# Altium schematic sheet P1.schdoc
size 127 x 101 mm
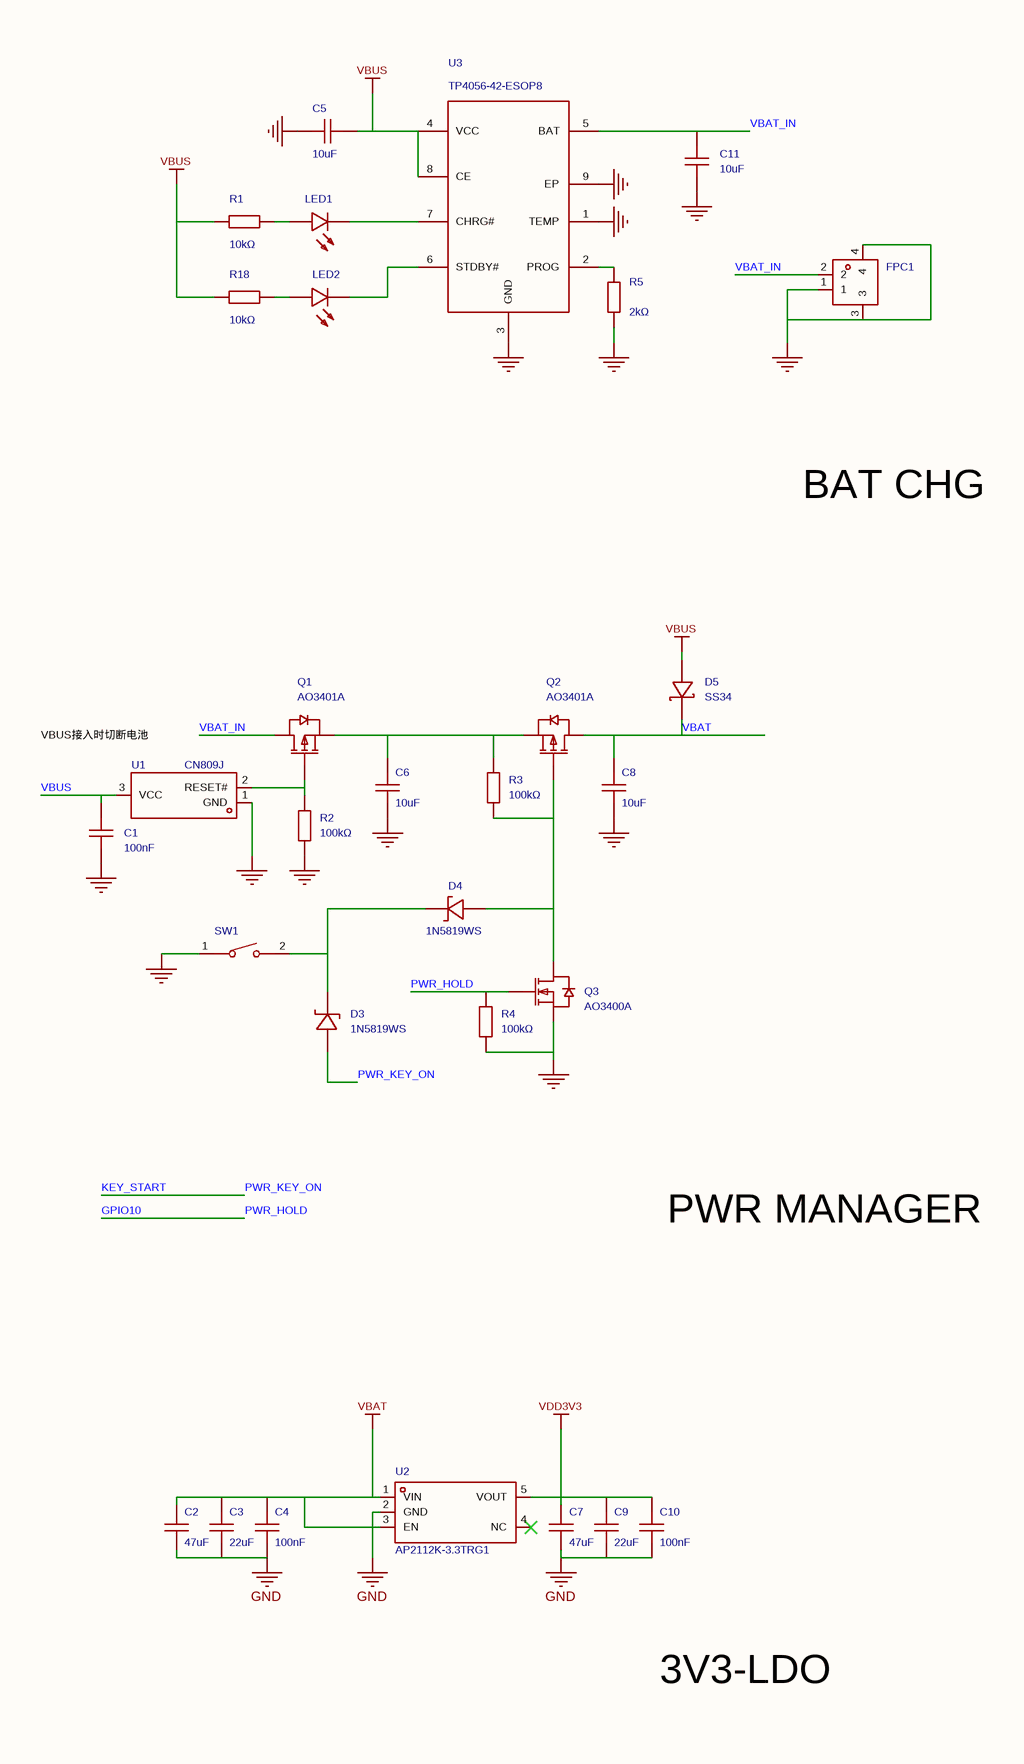
[diagram p0: P1.schdoc, left]
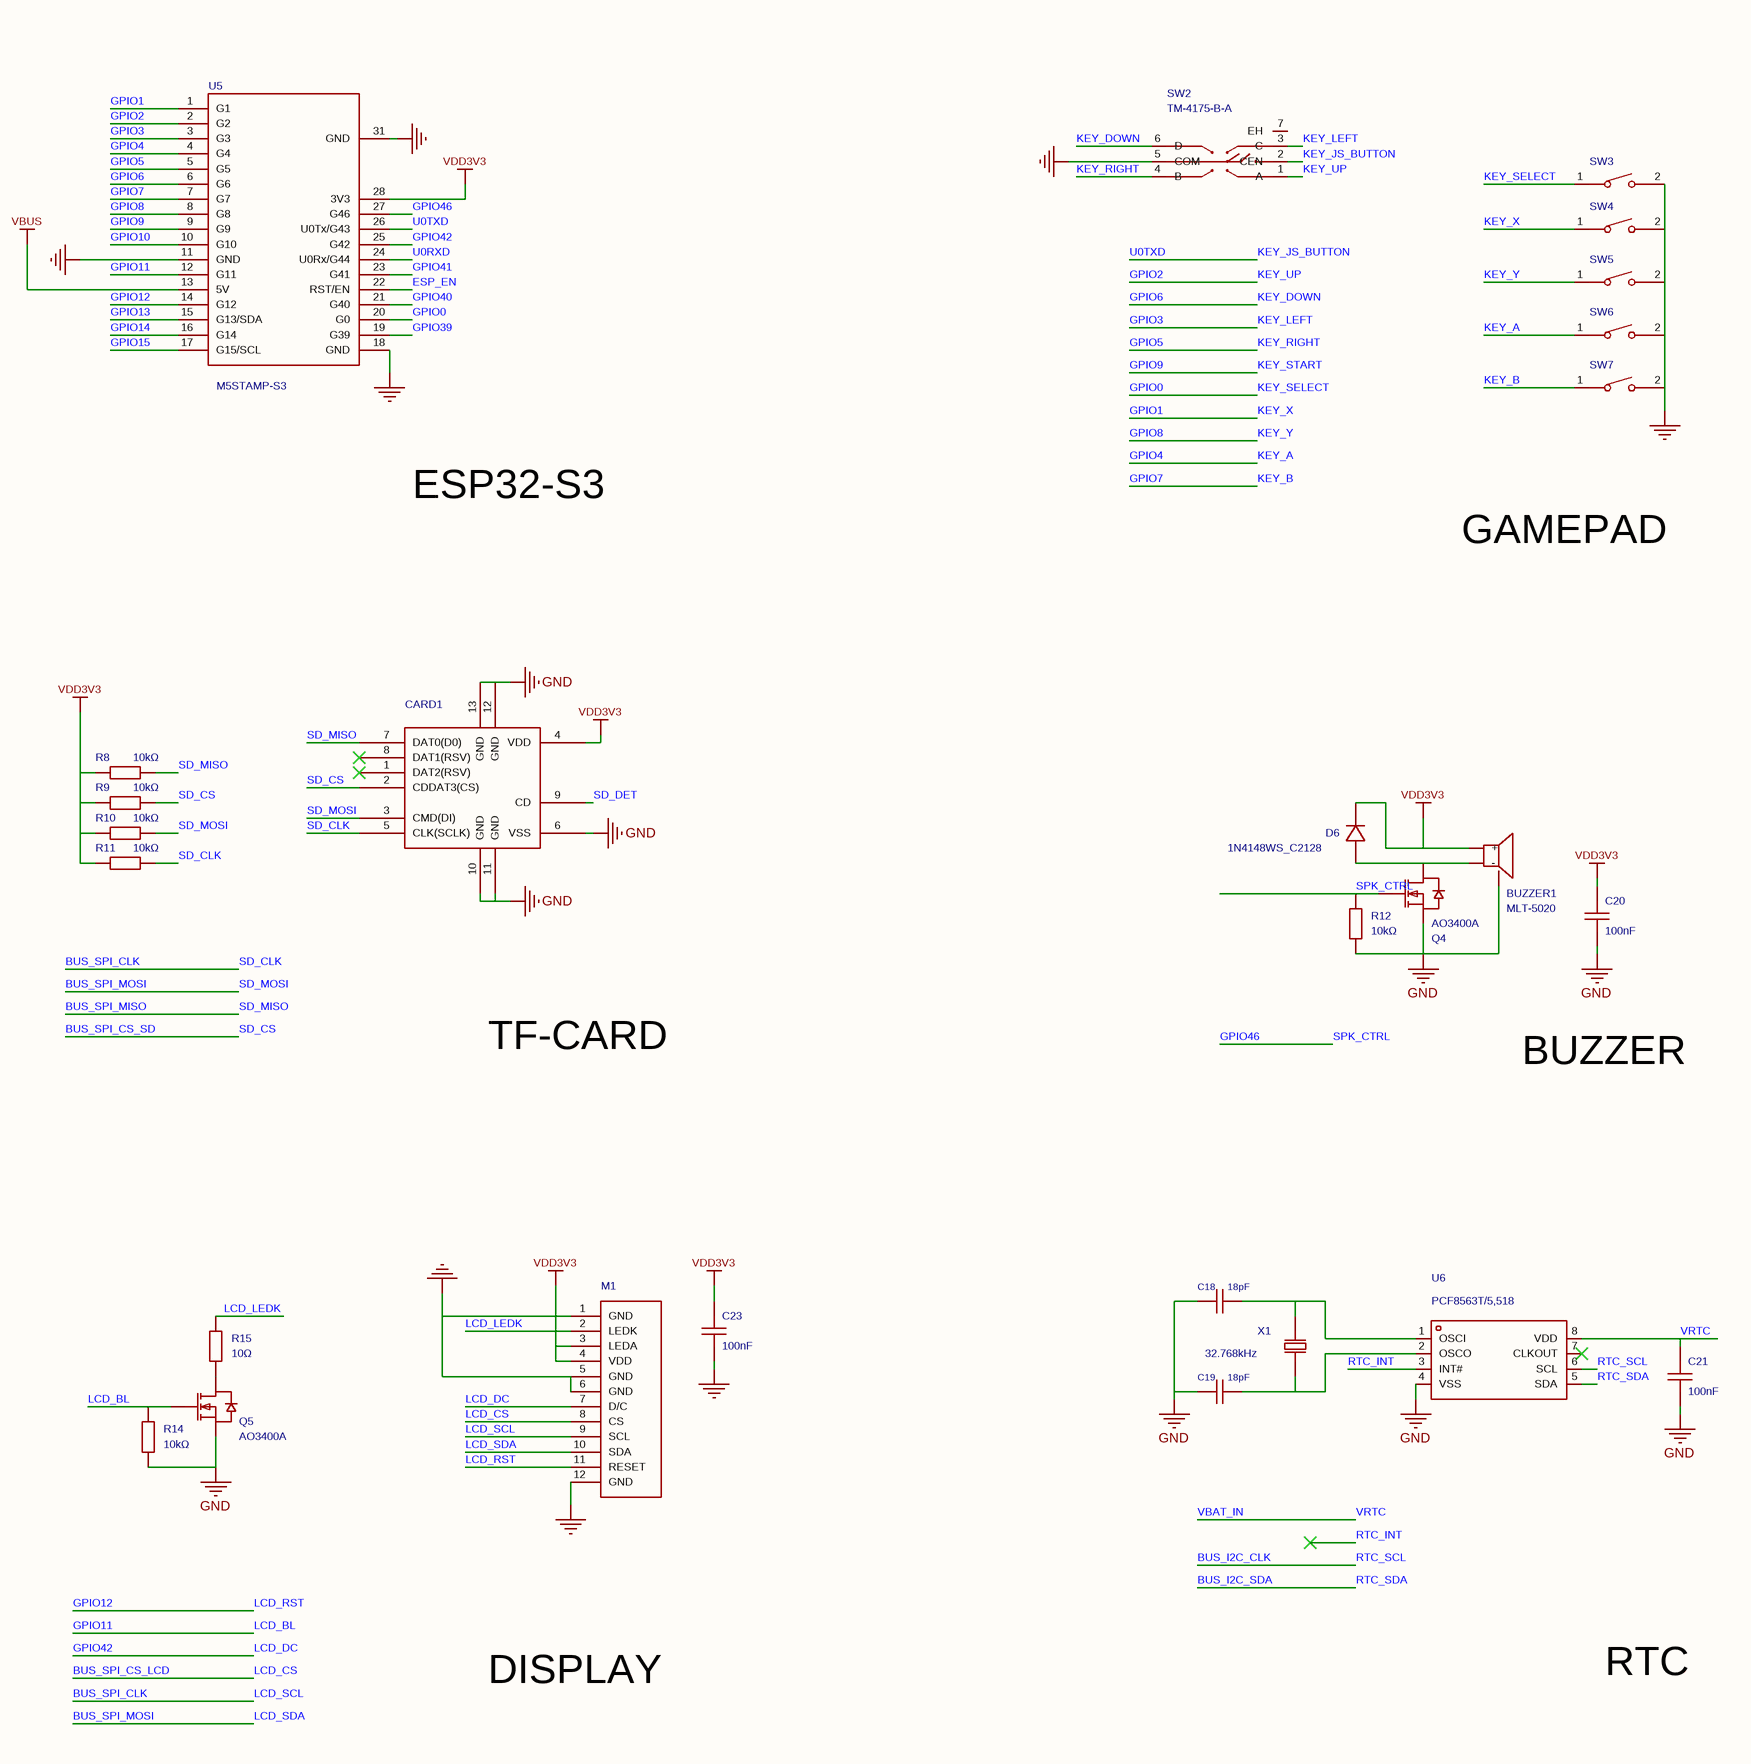
[diagram p1: P1.schdoc, middle]
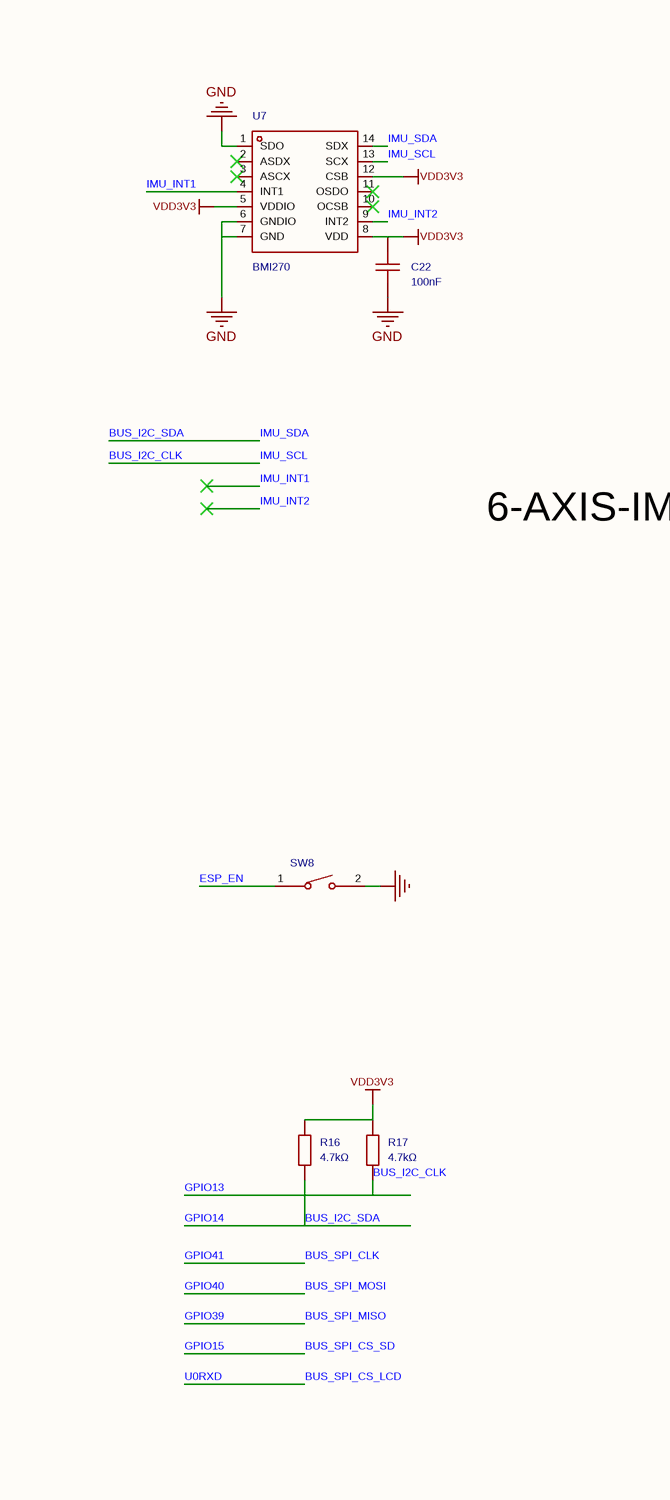
[diagram p2: P1.schdoc, right]

## Parts
BUZZER1  4000Hz  [BUZ-SMD_L5.0-W5.5-P4.60]  (value not drawn)
C1  100nF  [C0603]
C2  47uF  [C0805]
C3  22uF  [C0805]
C4  100nF  [C0603]
C5  10uF  [C0603]
C6  10uF  [C0603]
C7  47uF  [C0805]
C8  10uF  [C0603]
C9  22uF  [C0805]
C10  100nF  [C0603]
C11  10uF  [C0603]
C18  18pF  [C0603]
C19  18pF  [C0603]
C20  100nF  [C0603]
C21  100nF  [C0603]
C22  100nF  [C0603]
C23  100nF  [C0603]
CARD1  (no value)  [TF-SMD_TF-01A]
D3  1N5819WS  [SOD-323_L1.8-W1.3-LS2.5-RD]
D4  1N5819WS  [SOD-323_L1.8-W1.3-LS2.5-RD]
D5  SS34  [SMA_L4.3-W2.6-LS5.2-RD]
D6  1N4148WS  [SOD-323_L1.8-W1.3-LS2.5-RD]  (value not drawn)
FPC1  1.25-2PWB  [CONN-SMD_2P-P1.25_DEALON_1.25-2PWB]  (value not drawn)
LED1  19-213/Y2C-CQ2R2L/3T(CY)  [LED0603-RD-YELLOW]  (value not drawn)
LED2  19-217/GHC-YR1S2/3T  [LED0603-RD]  (value not drawn)
M1  1.3寸TFT240*240  [1.3寸TFT240_240]  (value not drawn)
Q1  AO3401A  [SOT-23_L2.9-W1.3-P1.90-LS2.4-BR]
Q2  AO3401A  [SOT-23_L2.9-W1.3-P1.90-LS2.4-BR]
Q3  AO3400A  [sot-23_l2.9-w1.3-p1.90-ls2.4-br]
Q4  AO3400A  [sot-23_l2.9-w1.3-p1.90-ls2.4-br]
Q5  AO3400A  [sot-23_l2.9-w1.3-p1.90-ls2.4-br]
R1  10kΩ  [R0603]
R2  100kΩ  [R0603]
R3  100kΩ  [R0603]
R4  100kΩ  [R0603]
R5  2kΩ  [R0603]
R8  10kΩ  [R0603]
R9  10kΩ  [R0603]
R10  10kΩ  [R0603]
R11  10kΩ  [R0603]
R12  10kΩ  [R0603]
R14  10kΩ  [R0603]
R15  10Ω  [R0603]
R16  4.7kΩ  [R0603]
R17  4.7kΩ  [R0603]
R18  10kΩ  [R0603]
SW1  TS-1088-AR02016  [SW-SMD_L3.9-W3.0-P4.45]  (value not drawn)
SW2  TM-4175-B-A  [SW-SMD_TM-4175-B-X]
SW3  TS-1088-AR02016  [SW-SMD_L3.9-W3.0-P4.45]  (value not drawn)
SW4  TS-1088-AR02016  [SW-SMD_L3.9-W3.0-P4.45]  (value not drawn)
SW5  TS-1088-AR02016  [SW-SMD_L3.9-W3.0-P4.45]  (value not drawn)
SW6  TS-1088-AR02016  [SW-SMD_L3.9-W3.0-P4.45]  (value not drawn)
SW7  TS-1088-AR02016  [SW-SMD_L3.9-W3.0-P4.45]  (value not drawn)
SW8  TS-1088-AR02016  [SW-SMD_L3.9-W3.0-P4.45]  (value not drawn)
U1  CN809J  [SOT-23-3_L2.9-W1.3-P1.90-LS2.4-BR]
U2  AP2112K-3.3TRG1  [SOT-25-5_L3.0-W1.8-P0.95-LS3.0-BR]
U3  TP4056-42-ESOP8  [ESOP-8_L4.9-W3.9-P1.27-LS6.0-BL-EP]
U5  M5STAMP-S3  [STAMP-S3-PIN-SMD]
U6  PCF8563T/5,518  [SOIC-8_L5.0-W4.0-P1.27-LS6.0-BL]
U7  BMI270  [LGA-14_L3.0-W2.5-P0.50-BR]
X1  32.768kHz  [FC-135R_L3.2-W1.5]

## Nets
GND: BUZZER1.3(NC) C1.1 C2.1 C3.1 C4.1 C5.2 C6.1 C7.1 C8.1 C9.1 C10.1 C11.1 C18.1 C19.1 C20.1 C21.1 C22.1 C23.1 CARD1.6(VSS) CARD1.10(GND) CARD1.11(GND) CARD1.12(GND) CARD1.13(GND) FPC1.1 FPC1.3 FPC1.4 M1.1(GND) M1.5(GND) M1.6(GND) M1.12(GND) Q3.2(S) Q4.2(S) Q5.2(S) R2.1 R4.1 R5.1 R12.2 R14.2 SW1.1 SW2.5(COM) SW3.2 SW4.2 SW5.2 SW6.2 SW7.2 SW8.2 U1.1(GND) U2.2(GND) U3.1(TEMP) U3.3(GND) U3.9(EP) U5.11(GND) U5.18(GND) U5.31(GND) U6.4(VSS) U7.1(SDO) U7.6(GNDIO) U7.7(GND)
VBAT: C2.2 C3.2 C4.2 C8.2 D5.1(K) Q2.3(D) U2.1(VIN) U2.3(EN)
VBUS: C1.2 C5.1 D5.2(A) R1.1 R18.1 U1.3(VCC) U3.4(VCC) U3.8(CE) U5.13(5V)
VDD3V3: BUZZER1.1(+) C7.2 C9.2 C10.2 C20.2 C22.2 C23.2 CARD1.4(VDD) D6.1(K) M1.3(LEDA) M1.4(VDD) R8.2 R9.2 R10.2 R11.2 R16.2 R17.2 U2.5(VOUT) U5.28(3V3) U7.5(VDDIO) U7.8(VDD) U7.12(CSB)
BUS_I2C_CLK: R17.1 U5.15(G13/SDA) U6.6(SCL) U7.13(SCX)  [also labelled GPIO13, IMU_SCL, RTC_SCL]
BUS_I2C_SDA: R16.1 U5.16(G14) U6.5(SDA) U7.14(SDX)  [also labelled GPIO14, IMU_SDA, RTC_SDA]
BUS_SPI_CLK: CARD1.5(CLK(SCLK)) M1.9(SCL) R11.1 U5.23(G41)  [also labelled GPIO41, LCD_SCL, SD_CLK]
BUS_SPI_CS_LCD: M1.8(CS) U5.24(U0Rx/G44)  [also labelled LCD_CS, U0RXD]
BUS_SPI_CS_SD: CARD1.2(CDDAT3(CS)) R9.1 U5.17(G15/SCL)  [also labelled GPIO15, SD_CS]
BUS_SPI_MISO: CARD1.7(DAT0(D0)) R8.1 U5.19(G39)  [also labelled GPIO39, SD_MISO]
BUS_SPI_MOSI: CARD1.3(CMD(DI)) M1.10(SDA) R10.1 U5.21(G40)  [also labelled GPIO40, LCD_SDA, SD_MOSI]
ESP_EN: SW8.1 U5.22(RST/EN)
GPIO0: SW3.1 U5.20(G0)  [also labelled KEY_SELECT]
GPIO1: SW4.1 U5.1(G1)  [also labelled KEY_X]
GPIO2: SW2.1(A) U5.2(G2)  [also labelled KEY_UP]
GPIO3: SW2.3(C) U5.3(G3)  [also labelled KEY_LEFT]
GPIO4: SW6.1 U5.4(G4)  [also labelled KEY_A]
GPIO5: SW2.4(B) U5.5(G5)  [also labelled KEY_RIGHT]
GPIO6: SW2.6(D) U5.6(G6)  [also labelled KEY_DOWN]
GPIO7: SW7.1 U5.7(G7)  [also labelled KEY_B]
GPIO8: SW5.1 U5.8(G8)  [also labelled KEY_Y]
GPIO9: D3.2(A) U5.9(G9)  [also labelled KEY_START, PWR_KEY_ON]
GPIO10: Q3.1(G) R4.2 U5.10(G10)  [also labelled PWR_HOLD]
GPIO11: Q5.1(G) R14.1 U5.12(G11)  [also labelled LCD_BL]
GPIO12: M1.11(RESET) U5.14(G12)  [also labelled LCD_RST]
GPIO42: M1.7(D/C) U5.25(G42)  [also labelled LCD_DC]
GPIO46: Q4.1(G) R12.1 U5.27(G46)  [also labelled SPK_CTRL]
IMU_INT1: U7.4(INT1)
IMU_INT2: U7.9(INT2)
KEY_JS_BUTTON: SW2.2(CEN) U5.26(U0Tx/G43)  [also labelled U0TXD]
LCD_LEDK: M1.2(LEDK) R15.2
RTC_INT: U6.3(INT#)
SD_DET: CARD1.9(CD)
VBAT_IN: C11.2 C21.2 FPC1.2 Q1.3(D) U3.5(BAT) U6.8(VDD)  [also labelled VRTC]
NetBUZZER1_2: BUZZER1.2(-) D6.2(A) Q4.3(D)
NetC6_2: C6.2 Q1.2(S) Q2.2(S) R3.2
NetC18_2: C18.2 U6.1(OSCI) X1.1
NetC19_2: C19.2 U6.2(OSCO) X1.2
NetD3_1: D3.1(C) D4.1(C) SW1.2
NetD4_2: D4.2(A) Q2.1(G) Q3.3(D) R3.1
NetLED1_1: LED1.1(C) U3.7(CHRG#)
NetLED1_2: LED1.2(A) R1.2
NetLED2_1: LED2.1(C) U3.6(STDBY#)
NetLED2_2: LED2.2(A) R18.2
NetQ1_1: Q1.1(G) R2.2 U1.2(RESET#)
NetQ5_3: Q5.3(D) R15.1
NetR5_2: R5.2 U3.2(PROG)

Not connected (* = marked no-connect by the designer): CARD1 1(DAT2(RSV))* 8(DAT1(RSV))*; SW2 7(EH); U2 4(NC)*; U6 7(CLKOUT)*; U7 2(ASDX)* 3(ASCX)* 10(OCSB)* 11(OSDO)*

## Notes on the sheet
- BAT CHG
- ESP32-S3
- GAMEPAD
- 6-AXIS-IMU
- VBUS接入时切断电池
- TF-CARD
- BUZZER
- PWR MANAGER
- 3V3-LDO
- DISPLAY
- RTC

## Library data of the parts
BUZZER1 = MLT-5020: 驱动方式:无源(外部驱动);构造类型:电磁式;频率:4000Hz;长度:5.2mm;宽度:5.2mm;高度:2.5mm;; Manufacturer: 华能; AddInBom: yes; ModelId: 0044e78390e14de39818311c3b0a8804; ModelName: BUZ-SMD_3P-L5.2-W5.2-H2.0-P3.50; ModelTransform: 207.31557,204.724,0,270,0,0,-0.001,0.003,0; Technology Type: 电磁式; Symbol: MLT-5020; Device: MLT-5020; LCSC Part Name: MLT-5020; SupplierPart: C94598; ManufacturerPart: MLT-5020; Supplier Footprint: SMD,5x5mm; JLCPCB Part Class: 扩展库; Datasheet: https://atta.szlcsc.com/upload/public/pdf/source/20210811/111454390007D221D7259018FB170E62.pdf; Supplier: LCSC; ConvertToPcb: yes; FootprintName: BUZ-SMD_L5.0-W5.5-P4.60; Oscillator Circuit: 无源(外部驱动); Value: 4000Hz; Length: 5.2mm; Width: 5.2mm; Height: 2.5mm
C1 C4 C10 C20-C23 = CC0603KRX7R9BB104: 容值:100nF;精度:±10%;额定电压:50V;材质(温度系数):X7R;; Manufacturer: YAGEO(国巨); AddInBom: yes; ModelId: ac125912035d415993ca9572d50418b1; ModelName: C0603_L1.6-W0.8-H0.8; ModelTransform: 62.992,31.496,0,0,0,0,0,0,0; Tolerance: ±10%; Voltage Rated: 50V; Temperature Coefficient: X7R; Symbol: CC0603KRX7R9BB104; Value: 100nF; Device: CC0603KRX7R9BB104; LCSC Part Name: 100nF ±10% 50V; SupplierPart: C14663; ManufacturerPart: CC0603KRX7R9BB104; Supplier Footprint: 0603; JLCPCB Part Class: 基础库; Datasheet: https://atta.szlcsc.com/upload/public/pdf/source/20180910/C282072_33301C7F631E79921B82A8DAC6BCC5B3.pdf; Supplier: LCSC; ConvertToPcb: yes; FootprintName: C0603
C2 C7 = CL21A476MQYNNNE: 容值:47uF;精度:±20%;额定电压:6.3V;材质(温度系数):X5R;; Manufacturer: SAMSUNG(三星); AddInBom: yes; ModelId: 1ba041120af144c991958decab20d241; ModelName: C0805_L2.0-W1.3-H1.3; ModelTransform: 78.74,51.181,0,0,0,0,0,0.0005,0; Tolerance: ±20%; Voltage Rated: 6.3V; Temperature Coefficient: X5R; Symbol: CL21A476MQYNNNE; Value: 47uF; Device: CL21A476MQYNNNE; LCSC Part Name: 47uF ±20% 6.3V; SupplierPart: C16780; ManufacturerPart: CL21A476MQYNNNE; Supplier Footprint: 0805; JLCPCB Part Class: 基础库; Datasheet: https://atta.szlcsc.com/upload/public/pdf/source/20160103/1457707690276.pdf; Supplier: LCSC; ConvertToPcb: yes; FootprintName: C0805
C3 C9 = CL21A226MAQNNNE_C45783: 容值:22uF;精度:±20%;额定电压:25V;材质(温度系数):X5R;; Manufacturer: SAMSUNG(三星); AddInBom: yes; ModelId: 1ba041120af144c991958decab20d241; ModelName: C0805_L2.0-W1.3-H1.3; ModelTransform: 78.74,51.181,0,0,0,0,0,0.0005,0; Tolerance: ±20%; Voltage Rated: 25V; Temperature Coefficient: X5R; Symbol: CL21A226MAQNNNE; Value: 22uF; Device: CL21A226MAQNNNE_C45783; LCSC Part Name: 22uF ±20% 25V; SupplierPart: C45783; ManufacturerPart: CL21A226MAQNNNE; Supplier Footprint: 0805; JLCPCB Part Class: 基础库; Datasheet: https://atta.szlcsc.com/upload/public/pdf/source/20160103/1457707727161.pdf; Supplier: LCSC; ConvertToPcb: yes; FootprintName: C0805
C5 C6 C8 C11 = CL10A106KP8NNNC: 容值:10uF;精度:±10%;额定电压:10V;材质(温度系数):X5R;; Manufacturer: SAMSUNG(三星); AddInBom: yes; ModelId: ac125912035d415993ca9572d50418b1; ModelName: C0603_L1.6-W0.8-H0.8; ModelTransform: 62.992,31.496,0,0,0,0,0,0,0; Tolerance: ±10%; Voltage Rated: 10V; Temperature Coefficient: X5R; Symbol: CL10A106KP8NNNC; Value: 10uF; Device: CL10A106KP8NNNC; LCSC Part Name: 10uF ±10% 10V; SupplierPart: C19702; ManufacturerPart: CL10A106KP8NNNC; Supplier Footprint: 0603; JLCPCB Part Class: 基础库; Datasheet: https://atta.szlcsc.com/upload/public/pdf/source/20160103/1457707703378.pdf; Supplier: LCSC; ConvertToPcb: yes; FootprintName: C0603
C18 C19 = CL10C180JB8NNNC: 温度系数:C0G;容值:18pF;精度:±5%;额定电压:50V;; Manufacturer: SAMSUNG(三星); AddInBom: yes; ModelId: ac125912035d415993ca9572d50418b1; ModelName: C0603_L1.6-W0.8-H0.8; ModelTransform: 62.992,31.496,0,0,0,0,0,0,0; Temperature Coefficient: C0G; Tolerance: ±5%; Voltage Rated: 50V; Symbol: CL10C180JB8NNNC; Value: 18pF; Device: CL10C180JB8NNNC; Supplier: LCSC; Manufacturer Part: CL10C180JB8NNNC; Supplier Part: C1647; JLCPCB Part Class: 基础库; LCSC Part Name: 18pF(180) ±5% 50V; Supplier Footprint: 0603; ConvertToPcb: yes; FootprintName: C0603
CARD1 = TF-01A: 卡连接方式:自弹式;卡类型:MicroSD卡(TF卡);连接器类型:卡座;本体最大高度:-;触头材质:-;触头镀层:-;工作温度范围:-;焊接温度(最大值):-;; Manufacturer: 韩国韩荣; AddInBom: yes; ModelId: 5b4be50223494db9bf5c92b2cb3c1375; ModelName: TF-SMD_L14.8-W14.5-H1.9-P1.1; ModelTransform: 629.92,600.393,0,0,0,0,0,-85.473,-23.622; Card Connection Mode: 自弹式; Connector Type: 卡座; Symbol: TF-01A; Device: TF-01A; LCSC Part Name: 自弹式 MicroSD卡(TF卡) 卡座; SupplierPart: C91145; ManufacturerPart: TF-01A; Supplier Footprint: SMD; JLCPCB Part Class: Extended Part; Datasheet: https://atta.szlcsc.com/upload/public/pdf/source/20190322/C91145_63CBD6FB4639A3A3EC6A9721F18AE0FB.pdf; Supplier: LCSC; ConvertToPcb: yes; FootprintName: TF-SMD_TF-01A; Card Type: MicroSD卡(TF卡); Maximum Body Height: -; Contact Material: -; Contact Plating: -; Operating Temperature Range: -; Welding Temperature (Max): -
D3 D4 = 1N5819WS_C191023: 直流反向耐压(Vr):40V;平均整流电流(Io):1A;正向压降(Vf):600mV@1A;; Manufacturer: Hottech(合科泰); AddInBom: yes; ModelId: e9dd044ee7bf4221b3b795eb56bce7c0; ModelName: SOD-323_L1.7-W1.3-H1.1-LS2.5; ModelTransform: 98.91933,51.181,0,180,0,0,0.985,-0.0005,0; Reverse Voltage (Vr): 40V; Average Rectified Current (Io): 1A; Symbol: 1N5819WS; Manufacturer Part: 1N5819WS; Device: 1N5819WS_C191023; LCSC Part Name: 40V 1A 600mV@1A; SupplierPart: C191023; Supplier Footprint: SOD-323; JLCPCB Part Class: 基础库; Datasheet: https://atta.szlcsc.com/upload/public/pdf/source/20220428/3CB86FD8D28D653594B4E35F9D5AEFD9.pdf; Supplier: LCSC; ConvertToPcb: yes; FootprintName: SOD-323_L1.8-W1.3-LS2.5-RD; Forward Voltage (Vf@If): 600mV@1A
D5 = SS34_C8678: 二极管配置:独立式;直流反向耐压(Vr):40V;平均整流电流(Io):3A;正向压降(Vf):550mV@3A;; Manufacturer: MDD; AddInBom: yes; ModelId: 7ed2c9d0a4a74bbdbba07ab4052caf5b; ModelTransform: 185.039,102.362,0,0,0,0,0,0,0; Diode Configuration: 独立式; Reverse Voltage (Vr): 40V; Average Rectified Current (Io): 3A; Reverse Leakage Current (Ir): 500uA@40V; Symbol: SS34_C8678; Manufacturer Part: SS34; Device: SS34_C8678; LCSC Part Name: 40V 3A 550mV@3A; SupplierPart: C8678; Supplier Footprint: SMA(DO-214AC); JLCPCB Part Class: 基础库; Datasheet: https://atta.szlcsc.com/upload/public/pdf/source/20230314/A80AE34493C69B89E2F4B1712F433538.pdf; Supplier: LCSC; ConvertToPcb: yes; FootprintName: SMA_L4.3-W2.6-LS5.2-RD; ModelName: SMA_L4.3-W2.6-LS5.2-RD; Forward Voltage (Vf@If): 550mV@3A
D6 = 1N4148WS_C2128: 二极管配置:独立式;功率:200mW;直流反向耐压(Vr):100V;平均整流电流(Io):150mA;正向压降(Vf):1.25V@150mA;反向电流(Ir):1uA@75V;反向恢复时间(trr):4ns;工作温度:+150℃@(Tj);; Manufacturer: CJ(江苏长电/长晶); Symbol: 1N4148WS T4; AddInBom: yes; ModelId: e9dd044ee7bf4221b3b795eb56bce7c0; ModelName: SOD-323_L1.7-W1.3-H1.1-LS2.5; ModelTransform: 98.91933,51.181,0,180,0,0,0.985,-0.0005,0; Diode Configuration: 独立式; Power Dissipation: 200mW; Reverse Voltage (Vr): 100V; Average Rectified Current (Io): 150mA; Reverse Recovery Time (trr): 4ns; Device: 1N4148WS_C2128; LCSC Part Name: 100V 150mA 4ns T4; SupplierPart: C2128; ManufacturerPart: 1N4148WS; Supplier Footprint: SOD-323; JLCPCB Part Class: 基础库; Datasheet: https://atta.szlcsc.com/upload/public/pdf/source/20140809/1457707208178.pdf; Supplier: LCSC; ConvertToPcb: yes; FootprintName: SOD-323_L1.8-W1.3-LS2.5-RD; Forward Voltage (Vf@If): 1.25V@150mA; Reverse Leakage Current: 1uA@75V; Operating Temperature: +150℃@(Tj)
FPC1 = 1.25-2PWB: 参考系列:-;间距:1.25mm;插针结构:1x2P;排数:1;每排PIN数:2;行距:-;公母:公型插针;安装方式:卧贴;额定电流:-;工作温度范围:-40℃~+85℃;; Manufacturer: DEALON(德艺隆); AddInBom: yes; ModelId: 9acbac5bbda042939c64ce5e8a61b6c2; ModelTransform: 285.4325,206.693,0,180,0,0,0,-36.85,0; Pitch: 1.25mm; Pins Structure: 1x2P; Number of PINs Per Row: 2; Gender: 公型插针; Symbol: 1.25-2PWB; Device: 1.25-2PWB; LCSC Part Name: 1.25mm 1x2P 卧贴; SupplierPart: C2905009; ManufacturerPart: 1.25-2PWB; Supplier Footprint: SMD,P=1.25mm; JLCPCB Part Class: 扩展库; Datasheet: https://atta.szlcsc.com/upload/public/pdf/source/20211025/32B11FCE5054D08D2841E43E3DE676AA.pdf; Supplier: LCSC; ConvertToPcb: yes; FootprintName: CONN-SMD_2P-P1.25_DEALON_1.25-2PWB; ModelName: CONN-SMD_2P-P1.25_DEALON_1.25-2PWB; Reference Series: -; Number of Rows: 1; Row Spacing: -; Mounting Style: 卧贴; Current Rating (Max): -; Operating Temperature Range: -40℃~+85℃
LED1 = 19-213/Y2C-CQ2R2L/3T(CY): 发光颜色:黄灯;二极管配置:-;主波长:585.5nm~591.5nm;色温:-;功率:60mW;安装方式:-;; Manufacturer: EVERLIGHT(亿光); AddInBom: yes; ModelId: a8fc7d5425514cf49dd600af0a7bb223; ModelTransform: 63.7794,32.283,0,0,0,0,-1.969,0,0; Emitted Color: 黄灯; Lens Color: 无色透明; Peak Wavelength: 591nm; Forward Current: 20mA; Power Dissipation: 60mW; Viewing Angle: 120°; Symbol: 19-213/Y2C-CQ2R2L/3T(CY); Device: 19-213/Y2C-CQ2R2L/3T(CY); LCSC Part Name: 黄灯; SupplierPart: C72038; ManufacturerPart: 19-213/Y2C-CQ2R2L/3T(CY); Supplier Footprint: 0603; JLCPCB Part Class: 基础库; Datasheet: https://atta.szlcsc.com/upload/public/pdf/source/20160507/1462613613586.pdf; Supplier: LCSC; ConvertToPcb: yes; FootprintName: LED0603-RD-YELLOW; ModelName: LED0603-RD-YELLOW; Diode Configuration: -; Dominant Wavelength: 585.5nm~591.5nm; Color Temperature: -; Mounting Sytle: -; Operating Temperature: -40℃~+85℃
LED2 = 19-217/GHC-YR1S2/3T: 发光颜色:翠绿;二极管配置:-;透镜颜色:无色透明;主波长:520nm~535nm;色温:-;发光强度:199mcd;功率:110mW;发光角度:120°;安装方式:-;工作温度:-40℃~+85℃;; Manufacturer: EVERLIGHT(亿光); AddInBom: yes; ModelId: 1f0d29a91be547639d425604e9b96ebb; ModelTransform: 63.7794,32.283,0,0,0,0,0,0,0; Emitted Color: 翠绿; Lens Color: 无色透明; Peak Wavelength: 518nm; Forward Current: 20mA; Forward Voltage (VF): 3.3V; Luminous Intensity: 199mcd; Power Dissipation: 110mW; Viewing Angle: 120°; Symbol: 19-217/GHC-YR1S2/3T; Device: 19-217/GHC-YR1S2/3T; Supplier: LCSC; Manufacturer Part: 19-217/GHC-YR1S2/3T; Supplier Part: C72043; JLCPCB Part Class: 基础库; LCSC Part Name: 翠绿; Supplier Footprint: 0603; Datasheet: https://atta.szlcsc.com/upload/public/pdf/source/20160507/1462613613780.pdf; ConvertToPcb: yes; FootprintName: LED0603-RD; ModelName: LED0603-RD; Diode Configuration: -; Dominant Wavelength: 520nm~535nm; Color Temperature: -; Mounting Sytle: -; Operating Temperature: -40℃~+85℃
M1 = 1.3寸TFT240*240: AddInBom: yes; Device: 1.3寸TFT240*240; ConvertToPcb: yes; SymbolName: 1.3寸TFT240*240; FootprintName: 1.3寸TFT240_240
Q1 Q2 = AO3401A_C15127: 类型:P沟道;漏源电压(Vdss):30V;连续漏极电流(Id):4A;功率(Pd):1.4W;导通电阻(RDS(on)@Vgs,Id):44mΩ@10V,4.3A;; Manufacturer: AOS; AddInBom: yes; ModelId: c62791f0466c4ae2a892c056b845b0ca; ModelName: SOT-23-3P_L2.9-W1.3-H1.0-LS2.4-P0.95; ModelTransform: 98.64468,114.173,0,180,0,0,0,0,0; Type: P沟道; Drain Source Voltage (Vdss): 30V; Continuous Drain Current (Id): 4A; Power Dissipation (Pd): 1.4W; Gate Threshold Voltage (Vgs(th)@Id): 1.3V@250uA; Symbol: AO3401A; Manufacturer Part: AO3401A; Device: AO3401A_C15127; LCSC Part Name: P沟道 30V 4A; SupplierPart: C15127; Supplier Footprint: SOT-23-3L; JLCPCB Part Class: 基础库; Datasheet: https://atta.szlcsc.com/upload/public/pdf/source/20160507/1462613609053.pdf; Supplier: LCSC; ConvertToPcb: yes; FootprintName: SOT-23_L2.9-W1.3-P1.90-LS2.4-BR; Drain Source On Resistance (RDS(on)@Vgs,Id): 44mΩ@10V,4.3A
Q3-Q5 = AO3400A_C20917: 类型:N沟道;漏源电压(Vdss):30V;连续漏极电流(Id):5.7A;功率(Pd):1.4W;导通电阻(RDS(on)@Vgs,Id):26.5mΩ@10V,5.7A;; Manufacturer: AOS; AddInBom: yes; ModelId: 89cb27a44ab2466697082bb9fd73a7d0; ModelName: SOT-23-3L_L2.9-W1.6-H1.1-LS2.8-P0.95; ModelTransform: 110.236,114.173,0,180,0,0,-0.005,0.0005,0; Type: N沟道; Drain Source Voltage (Vdss): 30V; Power Dissipation (Pd): 1.4W; Gate Threshold Voltage (Vgs(th)@Id): 1.5V@250uA; Symbol: AO3400A; Manufacturer Part: AO3400A; Device: AO3400A_C20917; LCSC Part Name: N沟道 30V 5.7A; SupplierPart: C20917; Supplier Footprint: SOT-23-3L; JLCPCB Part Class: 基础库; Datasheet: https://atta.szlcsc.com/upload/public/pdf/source/20140107/1457706668533.pdf; Supplier: LCSC; ConvertToPcb: yes; FootprintName: sot-23_l2.9-w1.3-p1.90-ls2.4-br; Continuous Drain Current (Id): 5.7A; Drain Source On Resistance (RDS(on)@Vgs,Id): 26.5mΩ@10V,5.7A
R1 R8-R12 R14 R18 = 0603WAF1002T5E: 电阻类型:厚膜电阻;阻值:10kΩ;精度:±1%;功率:100mW;; Manufacturer: UNI-ROYAL(厚声); AddInBom: yes; ModelId: fc143cca1e79419f9cd78b61e9279f08; ModelTransform: 31.8897,63.7794,0,90,0,0,0,0,0; Tolerance: ±1%; Power(Watts): 100mW; Temperature Coefficient: ±100ppm/℃; Overload Voltage (Max): 75V; Symbol: 0603WAF1002T5E; Value: 10kΩ; Device: 0603WAF1002T5E; LCSC Part Name: 厚膜电阻 10kΩ ±1% 100mW; SupplierPart: C25804; ManufacturerPart: 0603WAF1002T5E; Supplier Footprint: 0603; JLCPCB Part Class: 基础库; Datasheet: https://atta.szlcsc.com/upload/public/pdf/source/20200306/C422600_1E6D84923E4A46A82E41ADD87F860B5C.pdf; Supplier: LCSC; ConvertToPcb: yes; FootprintName: R0603; ModelName: R0603; Type: 厚膜电阻; Operating Temperature Range: -55℃~+155℃
R2-R4 = 0603WAF1003T5E: 电阻类型:厚膜电阻;阻值:100kΩ;精度:±1%;功率:100mW;; Manufacturer: UNI-ROYAL(厚声); AddInBom: yes; ModelId: fc143cca1e79419f9cd78b61e9279f08; ModelTransform: 31.8897,63.7794,0,90,0,0,0,0,0; Tolerance: ±1%; Power(Watts): 100mW; Temperature Coefficient: ±100ppm/℃; Overload Voltage (Max): 75V; Symbol: 0603WAF1003T5E; Value: 100kΩ; Device: 0603WAF1003T5E; LCSC Part Name: 100kΩ ±1% 100mW; SupplierPart: C25803; ManufacturerPart: 0603WAF1003T5E; Supplier Footprint: 0603; JLCPCB Part Class: 基础库; Datasheet: https://atta.szlcsc.com/upload/public/pdf/source/20200306/C422600_1E6D84923E4A46A82E41ADD87F860B5C.pdf; Supplier: LCSC; ConvertToPcb: yes; FootprintName: R0603; ModelName: R0603; Type: 厚膜电阻; Operating Temperature Range: -55℃~+155℃
R5 = 0603WAF2001T5E: 电阻类型:厚膜电阻;阻值:2kΩ;精度:±1%;功率:100mW;; Manufacturer: UNI-ROYAL(厚声); AddInBom: yes; ModelId: fc143cca1e79419f9cd78b61e9279f08; ModelTransform: 31.8897,63.7794,0,90,0,0,0,0,0; Tolerance: ±1%; Power(Watts): 100mW; Temperature Coefficient: ±100ppm/℃; Overload Voltage (Max): 75V; Symbol: 0603WAF2001T5E; Value: 2kΩ; Device: 0603WAF2001T5E; LCSC Part Name: 2kΩ ±1% 100mW; SupplierPart: C22975; ManufacturerPart: 0603WAF2001T5E; Supplier Footprint: 0603; JLCPCB Part Class: 基础库; Datasheet: https://atta.szlcsc.com/upload/public/pdf/source/20200306/C422600_1E6D84923E4A46A82E41ADD87F860B5C.pdf; Supplier: LCSC; ConvertToPcb: yes; FootprintName: R0603; ModelName: R0603; Type: 厚膜电阻; Operating Temperature Range: -55℃~+155℃
R15 = 0603WAF100JT5E: 电阻类型:厚膜电阻;阻值:10Ω;精度:±1%;功率:100mW;温度系数:±400ppm/℃;最大工作电压:75V;工作温度范围:-55℃~+155℃;; Manufacturer: UNI-ROYAL(厚声); AddInBom: yes; ModelId: 3281a289d46d4bb1877be1eabd090e13; ModelName: R0603_L1.6-W0.8-H0.8; ModelTransform: 62.992,31.496,0,0,0,0,0,0,0; Tolerance: ±1%; Power(Watts): 100mW; Overload Voltage (Max): 75V; Symbol: 0603WAF100JT5E; Value: 10Ω; Device: 0603WAF100JT5E; LCSC Part Name: 10Ω ±1% 100mW; SupplierPart: C22859; ManufacturerPart: 0603WAF100JT5E; Supplier Footprint: 0603; JLCPCB Part Class: 基础库; Datasheet: https://atta.szlcsc.com/upload/public/pdf/source/20200306/C422600_1E6D84923E4A46A82E41ADD87F860B5C.pdf; Supplier: LCSC; ConvertToPcb: yes; FootprintName: R0603; Type: 厚膜电阻; Temperature Coefficient: ±400ppm/℃; Operating Temperature Range: -55℃~+155℃
R16 R17 = 0603WAF4701T5E: 电阻类型:厚膜电阻;阻值:4.7kΩ;精度:±1%;功率:100mW;; Manufacturer: UNI-ROYAL(厚声); AddInBom: yes; ModelId: fc143cca1e79419f9cd78b61e9279f08; ModelTransform: 31.8897,63.7794,0,90,0,0,0,0,0; Tolerance: ±1%; Power(Watts): 100mW; Temperature Coefficient: ±100ppm/℃; Overload Voltage (Max): 75V; Symbol: 0603WAF4701T5E; Value: 4.7kΩ; Device: 0603WAF4701T5E; LCSC Part Name: 4.7kΩ ±1% 100mW; SupplierPart: C23162; ManufacturerPart: 0603WAF4701T5E; Supplier Footprint: 0603; JLCPCB Part Class: 基础库; Datasheet: https://atta.szlcsc.com/upload/public/pdf/source/20200306/C422600_1E6D84923E4A46A82E41ADD87F860B5C.pdf; Supplier: LCSC; ConvertToPcb: yes; FootprintName: R0603; ModelName: R0603; Type: 厚膜电阻; Operating Temperature Range: -55℃~+155℃
SW1 SW3-SW8 = TS-1088-AR02016: 触点电流:50mA;额定电压(DC):12V;绝缘电阻:100MΩ;电路结构:单刀单掷;安装方式:立贴;作用力:160gf@±50gf;机械寿命:10万次;带支架:否;; Manufacturer: XUNPU(讯普); AddInBom: yes; ModelId: b26698b69f274ffabef8a26c7d0e5dd1; ModelName: SW-SMD_L3.9-W2.9-H2.0-LS4.8; ModelTransform: 188.976,114.174,0,0,0,0,0,0,0; Contact Current: 50mA; Voltage Rating (DC): 12V; Insulation Resistance: 100MΩ; Circuit: 单刀单掷; Actuator Style: 圆形按钮; Actuator/Cap Color: 黑色; Mechanical Life: 10万次; Pin Style: SMD接片; Switch Length: 4mm; Switch Width: 3mm; Switch Height: 2mm; Strike Gundam: 否; Symbol: TS-1088-AR02016; Device: TS-1088-AR02016; LCSC Part Name: 4*3*2mm 立贴 轻触开关; SupplierPart: C720477; ManufacturerPart: TS-1088-AR02016; Supplier Footprint: SMD; JLCPCB Part Class: 扩展库; Datasheet: https://atta.szlcsc.com/upload/public/pdf/source/20200810/C720475_60D09DD6C54279ADDB2DC25100F1CC11.pdf; Supplier: LCSC; ConvertToPcb: yes; FootprintName: SW-SMD_L3.9-W3.0-P4.45; Mounting Style: 立贴; Operating Force: 160gf@±50gf; Operating Temperature: -30℃~+80℃
SW2 = TM-4175-B-A: 多功能开关 7.5*7.5*5 五向开关 H5; Manufacturer: XKB Connectivity(中国星坤); AddInBom: yes; ModelId: fa03cf810e604d4192717ee228c97197; ModelTransform: 295.275,334.645,0,0,0,0,-0.005,0,-19.685; Symbol: TM-4175-B-A; Device: TM-4175-B-A; LCSC Part Name: 多功能开关 7.5*7.5*5 五向开关 H5; SupplierPart: C465995; ManufacturerPart: TM-4175-B-A; Supplier Footprint: SMD-8P,7.5x7.5mm; JLCPCB Part Class: 扩展库; Datasheet: https://atta.szlcsc.com/upload/public/pdf/source/20211011/A0F6117F2AB0E02F6CF3847B7456F266.pdf; Supplier: LCSC; ConvertToPcb: yes; FootprintName: SW-SMD_TM-4175-B-X; ModelName: SW-SMD_TM-4175-B-X
U1 = CN809J: 电源管理芯片的类型:-;监控的组数:-;输出端类型:-;有效的复位电平:-;复位阀值电压:-;; Manufacturer: CONSONANCE(上海如韵); AddInBom: yes; ModelId: c62791f0466c4ae2a892c056b845b0ca; ModelName: SOT-23-3P_L2.9-W1.3-H1.0-LS2.4-P0.95; ModelTransform: 98.425,114.173,0,180,0,0,0.0005,-0.0005,0; Symbol: CN809J; Device: CN809J; LCSC Part Name: CN809J; SupplierPart: C840516; ManufacturerPart: CN809J; Supplier Footprint: SOT-23-3; JLCPCB Part Class: 扩展库; Datasheet: https://atta.szlcsc.com/upload/public/pdf/source/20200918/C840515_7DFC99A23260E65C6304EE619FD5F333.pdf; Supplier: LCSC; ConvertToPcb: yes; FootprintName: SOT-23-3_L2.9-W1.3-P1.90-LS2.4-BR; Type: -; Number of Voltages Monitored: -; Output: -; Reset: -; Reset Threshold Voltage: -
U2 = AP2112K-3.3TRG1: 输出类型:固定;输出极性:正;输出通道数:1;最大输入电压:6V;输出电压:3.3V;压差:400mV@(600mA);输出电流:600mA;电源纹波抑制比(PSRR):65dB@(100Hz,1kHz);; Manufacturer: DIODES(美台); AddInBom: yes; ModelId: 2af5e521bdd54ca3a4af644424b5a864; ModelName: SOT-25-5_L3.0-W1.6-H1.3-LS2.8-P0.95; ModelTransform: 110.7,118.1,0,180,0,0,-2.5,2.5,0; Output Type: 固定; Output Polarity: 正; Number of Outputs: 1; Maximum Input Voltage: 6V; Output Voltage: 3.3V; Symbol: AP2112K-3.3TRG1; Manufacturer Part: AP2112K-3.3TRG1; Device: AP2112K-3.3TRG1; LCSC Part Name: 正 Vin=6V Vout=3.3V 600mA 65dB@(100Hz,1kHz); SupplierPart: C51118; Supplier Footprint: SOT-25; JLCPCB Part Class: 扩展库; Datasheet: https://atta.szlcsc.com/upload/public/pdf/source/20171221/C51118_15138312998391195590.pdf; Supplier: LCSC; ConvertToPcb: yes; FootprintName: SOT-25-5_L3.0-W1.8-P0.95-LS3.0-BR; Dropout Voltage: 400mV@(600mA); Output Current: 600mA; Power Supply Rejection Ratio (PSRR): 65dB@(100Hz,1kHz)
U3 = TP4056-42-ESOP8: 锂电池充电芯片; Manufacturer: TOPPOWER(南京拓微); Symbol: TP4056; AddInBom: yes; ModelId: d3e00daa36c445139c055a3b9efb85d2; ModelName: ESOP-8_L4.9-W3.9-H1.6-LS6.0-P1.27; ModelTransform: 240.157,192.913,0,90,0,0,0,0,0; Device: TP4056-42-ESOP8; LCSC Part Name: TP4056-42-ESOP8 编带; SupplierPart: C16581; ManufacturerPart: TP4056-42-ESOP8; Supplier Footprint: ESOP-8; JLCPCB Part Class: 基础库; Datasheet: https://atta.szlcsc.com/upload/public/pdf/source/20160713/1468379849914.pdf; Supplier: LCSC; ConvertToPcb: yes; FootprintName: ESOP-8_L4.9-W3.9-P1.27-LS6.0-BL-EP
U5 = STAMP-S3-PIN-SMD: AddInBom: yes; ModelId: 5fd44e0520a141d1948b25da1d6120b7; ModelName: M5STAMP-S3_v0.1_2022-10-13; ModelTransform: 708.61,1021.5,257.43,0,0,0,0,-38.19,-77.56; Device: STAMP-S3-PIN-SMD; ConvertToPcb: yes; SymbolName: STAMP-S3-PIN-SMD; FootprintName: STAMP-S3-PIN-SMD
U6 = PCF8563T/5,518: 接口:I2C;; Manufacturer: NXP(恩智浦); AddInBom: yes; ModelId: e81d2f7d937b4a6ab1dca543ff5d56a4; ModelName: SOIC-8_L4.9-W3.9-H1.7-LS6.0-P1.27; ModelTransform: 189.751,236.22,0,0,0,0,-0.0005,0.0005,0; Interface: I2C; Operating Voltage: 1.8V~5.5V; Symbol: PCF8563T/5,518; Device: PCF8563T/5,518; LCSC Part Name: I2C 1.8V~5.5V MSL=2; SupplierPart: C7440; ManufacturerPart: PCF8563T/5,518; Supplier Footprint: SOIC-8; JLCPCB Part Class: 基础库; Datasheet: https://atta.szlcsc.com/upload/public/pdf/source/20140505/1457707048733.pdf; Supplier: LCSC; ConvertToPcb: yes; FootprintName: SOIC-8_L5.0-W4.0-P1.27-LS6.0-BL
U7 = BMI270: IMU-惯性测量单元; Manufacturer: Bosch(博世); AddInBom: yes; ModelId: 64f32784a16f466f897e9e56b6bbdf45; ModelTransform: 118.11,98.425,0,180,0,0,-0.002,0.004,0; Symbol: BMI270; LCSC Part Name: BMI270; Device: BMI270; SupplierPart: C2836813; ManufacturerPart: BMI270; Supplier Footprint: LGA-14(2.5x3); JLCPCB Part Class: 扩展库; Datasheet: https://atta.szlcsc.com/upload/public/pdf/source/20210625/C2836813_35E1F3F92097F45A3828DF13DDBA01A5.pdf; Supplier: LCSC; ConvertToPcb: yes; FootprintName: LGA-14_L3.0-W2.5-P0.50-BR; ModelName: LGA-14_L3.0-W2.5-P0.50-BR
X1 = Q13FC1350000400: 晶振类型:贴片无源晶振;频率:32.768kHz;频率公差:±20ppm;负载电容:12.5pF;等效串联电阻(ESR):70kΩ;工作温度:-40℃~+85℃;; Manufacturer: EPSON(爱普生); AddInBom: yes; ModelId: b5334dc599ac49d68fb741bd067a525d; ModelName: SMD-3215_2P_L3.2-W1.5-H0.8; ModelTransform: 125.984,59.055,0,0,0,0,0,0,0; Crystal Type: 贴片无源晶振; Frequency Tolerance: ±20ppm; Load Capacitance: 12.5pF; Equivalent Series Resistance (ESR): 70kΩ; Symbol: Q13FC1350000400; Value: 32.768kHz; Device: Q13FC1350000400; LCSC Part Name: 32.768kHz ±20ppm 12.5pF; SupplierPart: C32346; ManufacturerPart: Q13FC1350000400; Supplier Footprint: SMD3215-2P; JLCPCB Part Class: 基础库; Datasheet: https://atta.szlcsc.com/upload/public/pdf/source/20190108/C32346_746D6B07EAF90824457A96480007685F.pdf; Supplier: LCSC; ConvertToPcb: yes; FootprintName: FC-135R_L3.2-W1.5; Operating Temperature: -40℃~+85℃